# Altium schematic sheet EORE Connector and Filtering.SchDoc
size A
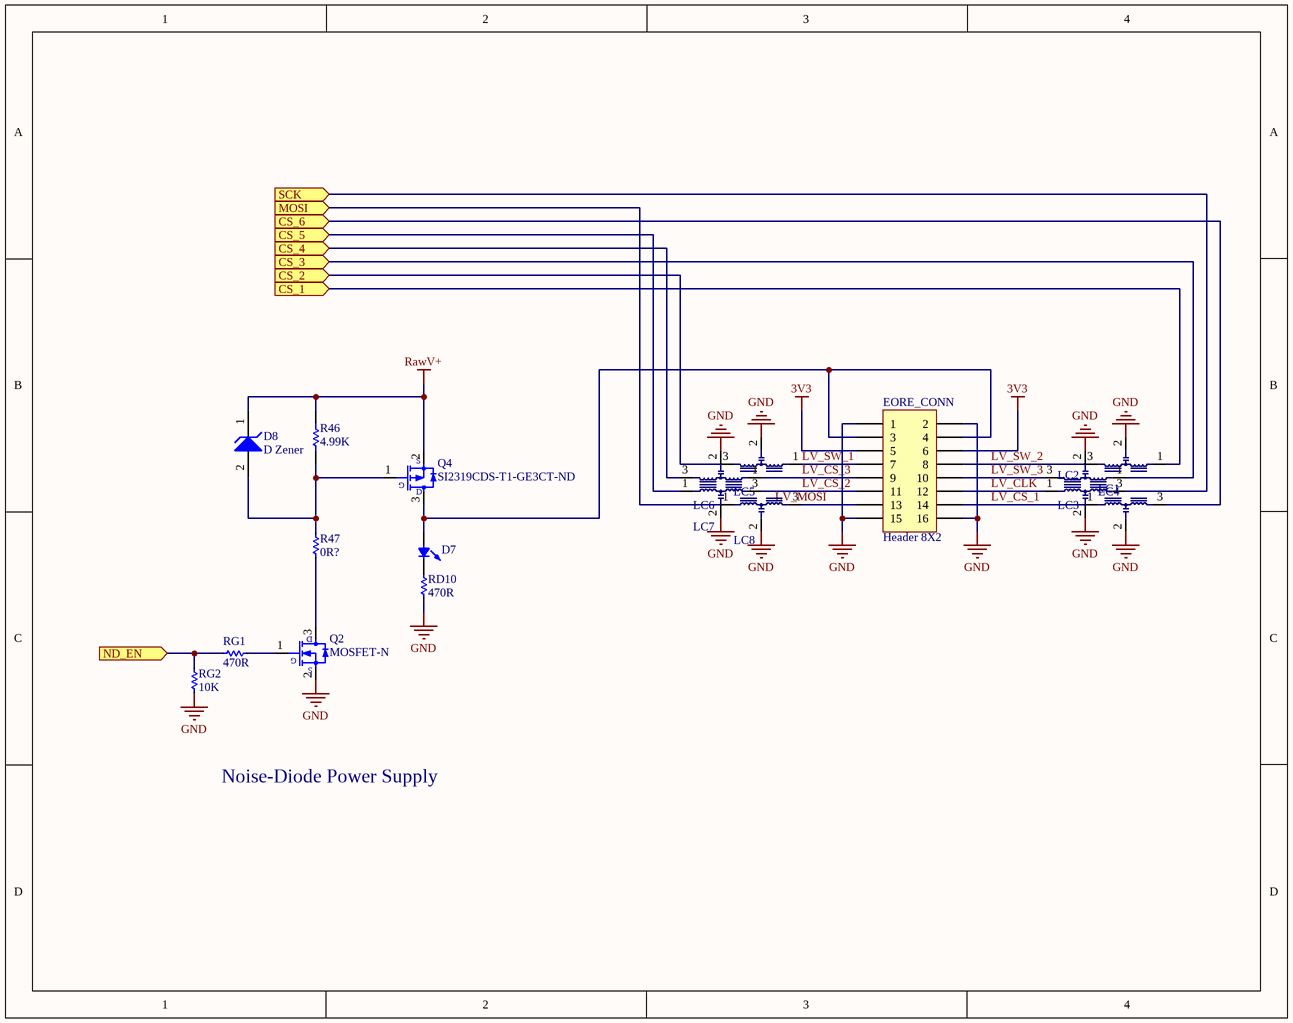
[diagram p0: EORE Connector and Filtering.SchDoc]

## Parts
D7  LED0  [0603 SMT LED]  (value not drawn)
D8  D Zener  [SOD123/X.85]
EORE_CONN  Header 8X2  [SMT 16-pin rectangular header]
LC1  MEM2012F  [MEM2012S LC Filter]  (value not drawn)
LC2  MEM2012F  [MEM2012S LC Filter]  (value not drawn)
LC3  MEM2012F  [MEM2012S LC Filter]  (value not drawn)
LC4  MEM2012F  [MEM2012S LC Filter]  (value not drawn)
LC5  MEM2012F  [MEM2012S LC Filter]  (value not drawn)
LC6  MEM2012F  [MEM2012S LC Filter]  (value not drawn)
LC7  MEM2012F  [MEM2012S LC Filter]  (value not drawn)
LC8  MEM2012F  [MEM2012S LC Filter]  (value not drawn)
Q2  MOSFET-N  [SOT23-3N]
Q4  SI2319CDS-T1-GE3CT-ND  [SOT23-3N]
R46  value 4.99K  [0603R]  (hidden comment: Res Semi)
R47  value 0R?  [0603R]  (hidden comment: Res Semi Small)
RD10  value 470R  [0603R]  (hidden comment: Res Semi Small)
RG1  value 470R  [0603R]  (hidden comment: Res Semi Small)
RG2  value 10K  [0603R]  (hidden comment: Res Semi Small)

## Ports
CS_1 (in), CS_2 (in), CS_3 (in), CS_4 (in), CS_5 (in), CS_6 (in), MOSI (in), ND_EN (in), SCK (in)

## Nets
3V3: EORE_CONN.5 EORE_CONN.6
GND: EORE_CONN.1 EORE_CONN.2 EORE_CONN.15 EORE_CONN.16 LC1.2 LC2.2 LC3.2 LC4.2 LC5.2 LC6.2 LC7.2 LC8.2 Q2.2(S) RD10.2 RG2.1
RawV+: D8.1(A) Q4.2(D) R46.2
CS_1: LC4.1 ; port CS_1
CS_2: LC5.3 ; port CS_2
CS_3: LC3.1 ; port CS_3
CS_4: LC6.3 ; port CS_4
CS_5: LC7.1 ; port CS_5
CS_6: LC1.3 ; port CS_6
LV_CLK: EORE_CONN.12 LC2.1
LV_CS_1: EORE_CONN.14 LC1.1
LV_CS_2: EORE_CONN.11 LC7.3
LV_CS_3: EORE_CONN.9 LC6.1
LV_SW_1: EORE_CONN.7 LC5.1
LV_SW_2: EORE_CONN.8 LC4.3
LV_SW_3: EORE_CONN.10 LC3.3
MOSI: LC8.1 ; port MOSI
ND_EN: RG1.1 RG2.2 ; port ND_EN
SCK: LC2.3 ; port SCK
NetD7_1: D7.1 EORE_CONN.3 EORE_CONN.4 Q4.3(S)
NetD7_2: D7.2 RD10.1
NetD8_2: D8.2(K) Q4.1(G) R46.1 R47.1
NetEORE_CONN_13: EORE_CONN.13 LC8.3
NetQ2_1: Q2.1(G) RG1.2
NetQ2_3: Q2.3(D) R47.2

## Notes on the sheet
- Noise-Diode Power Supply
- Labels drawn without touching a wire or pin: LV_MOSI

## Library data of the parts
D7 = LED0: T 1 3/4 LED; Published: 8-Jun-2000; LatestRevisionDate: 08-Jul-2005; LatestRevisionNote: Mech Layer 1 removed.; PackageReference: LED-0; Publisher: Altium Limited
D8 = D Zener: Zener Diode; Published: 8-Jun-2000; LatestRevisionDate: 17-Jul-2002; LatestRevisionNote: Re-released for DXP Platform.; PackageReference: DIODE-0.7; Publisher: Altium Limited
EORE_CONN = Header 8X2: Header, 8-Pin, Dual row; LatestRevisionDate: 17-Jul-2002; LatestRevisionNote: Re-released for DXP Platform.; Publisher: Altium Limited
LC1-LC8 = MEM2012F - Signal Filter: Signal Line 3-terminal Filters
Q2 = MOSFET-N: N-Channel MOSFET; Published: 8-Jun-2000; LatestRevisionDate: 17-Jul-2002; LatestRevisionNote: Re-released for DXP Platform.; PackageVersion: 1995/1996; PackageReference: E3; Publisher: Altium Limited
Q4 = MOSFET-P: P-Channel MOSFET; Published: 8-Jun-2000; LatestRevisionDate: 17-Jul-2002; LatestRevisionNote: Re-released for DXP Platform.; PackageVersion: 1995/1996; PackageReference: E3; Publisher: Altium Limited
R46 = Res Semi: Semiconductor Resistor; Published: 8-Jun-2000; LatestRevisionDate: 17-Jul-2002; LatestRevisionNote: Re-released for DXP Platform.; PackageReference: AXIAL-0.5; Publisher: Altium Limited
R47 RD10 RG1 RG2 = Res Semi Small: Semiconductor Resistor; Published: 8-Jun-2000; LatestRevisionDate: 17-Jul-2002; LatestRevisionNote: Re-released for DXP Platform.; PackageReference: AXIAL-0.5; Publisher: Altium Limited